# Altium schematic sheet Sheet1.SchDoc
size A; SheetNumber: 1; SheetTotal: 1
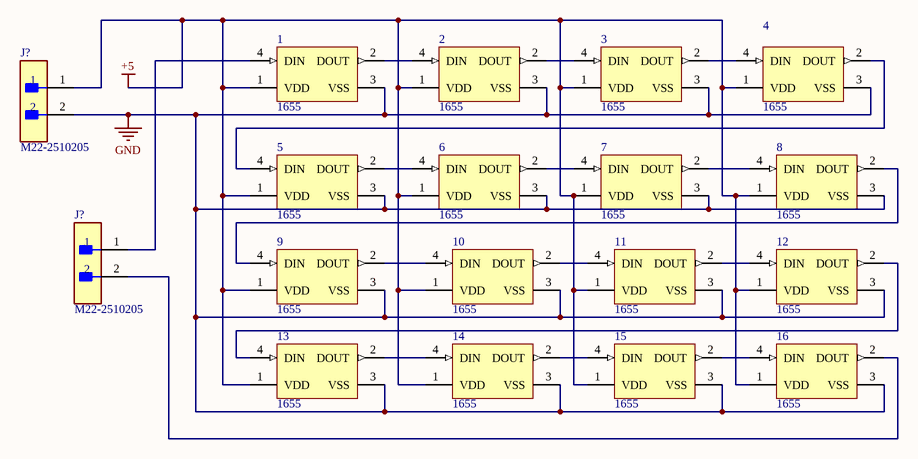
[diagram p0: Sheet1.SchDoc]

## Parts
(Parts that share a designator on the sheet are numbered #1, #2 ... from top to bottom, then left to right.)
1  1655  [ADA-RGB-1655_V]
2  1655  [ADA-RGB-1655_V]
3  1655  [ADA-RGB-1655_V]
4  1655  [ADA-RGB-1655_V]
5  1655  [ADA-RGB-1655_V]
6  1655  [ADA-RGB-1655_V]
7  1655  [ADA-RGB-1655_V]
8  1655  [ADA-RGB-1655_V]
9  1655  [ADA-RGB-1655_V]
10  1655  [ADA-RGB-1655_V]
11  1655  [ADA-RGB-1655_V]
12  1655  [ADA-RGB-1655_V]
13  1655  [ADA-RGB-1655_V]
14  1655  [ADA-RGB-1655_V]
15  1655  [ADA-RGB-1655_V]
16  1655  [ADA-RGB-1655_V]
J?#1  M22-2510205  [FP-M22-2510205-MFG]
J?#2  M22-2510205  [FP-M22-2510205-MFG]

## Nets
+5: 1.1(VDD) 2.1(VDD) 3.1(VDD) 4.1(VDD) 5.1(VDD) 6.1(VDD) 7.1(VDD) 8.1(VDD) 9.1(VDD) 10.1(VDD) 11.1(VDD) 12.1(VDD) 13.1(VDD) 14.1(VDD) 15.1(VDD) 16.1(VDD) J?#1.1
GND: 1.3(VSS) 2.3(VSS) 3.3(VSS) 4.3(VSS) 5.3(VSS) 6.3(VSS) 7.3(VSS) 8.3(VSS) 9.3(VSS) 10.3(VSS) 11.3(VSS) 12.3(VSS) 13.3(VSS) 14.3(VSS) 15.3(VSS) 16.3(VSS) J?#1.2
Net1_2: 1.2(DOUT) 2.4(DIN)
Net1_4: 1.4(DIN) J?#2.1
Net2_2: 2.2(DOUT) 3.4(DIN)
Net3_2: 3.2(DOUT) 4.4(DIN)
Net4_2: 4.2(DOUT) 5.4(DIN)
Net5_2: 5.2(DOUT) 6.4(DIN)
Net6_2: 6.2(DOUT) 7.4(DIN)
Net7_2: 7.2(DOUT) 8.4(DIN)
Net8_2: 8.2(DOUT) 9.4(DIN)
Net9_2: 9.2(DOUT) 10.4(DIN)
Net10_2: 10.2(DOUT) 11.4(DIN)
Net11_2: 11.2(DOUT) 12.4(DIN)
Net12_2: 12.2(DOUT) 13.4(DIN)
Net13_2: 13.2(DOUT) 14.4(DIN)
Net14_2: 14.2(DOUT) 15.4(DIN)
Net15_2: 15.2(DOUT) 16.4(DIN)
Net16_2: 16.2(DOUT) J?#2.2

## Library data of the parts
1-16 = CMP-2000-05026-1: Intelligent Control LED Integrated Light Source, 3.5 to 5.3 V, -25 to 80 degC, 4-Pin SMD, RoHS, Tape and Reel; Manufacturer: Adafruit-Industries-LLC; Number of LEDs: 10; Configuration: Discrete; Utilized LED: WS2812(5050); Datasheet URL: http://datasheet.octopart.com/ADA1655-Adafruit-Industries-datasheet-32028139.pdf; Series: Neopixel; Interface: -; Package Description: 4-Pin Surface Mount Device, Body 5 x 5 mm; Color: Red,Green,Blue(RGB); Category: Optoelectronics; Controller Type: -; Package Reference: 1655; Manufacturer URL: https://www.adafruit.com/; Mounting Type: SurfaceMount; Datasheet Version: May-13; Size / Dimension: 5.00mmLx5.00mmW; Family: Addressable,Specialty
J?#1 J?#2 = CMP-15831-000005-1: CONN HEADER VERT 2POS 2MM; Manufacturer: Harwin; Conn Gender: Male; Current Rating: 2A; Number Of Contacts: 2; Conn Orientation: Vertical; Temperature Range Low: -40°C; Device Class L1: Connectors; ComponentLink2URL: https://cdn.harwin.com/pdfs/C018XX_M22_Series_Connectors.pdf; Temperature Range High: +105°C; Pitch: 2mm; Number Of Rows: 1; Temperature: -40°C to +105°C; Automotive: No; Device Class L3: unset; Octopart: https://octopart.com/m22-2510205-harwin-2538221; Mouser Description: Headers & Wire Housings 2 PIN SIL VERTICAL GOLD PIN HEADER; Height: 5.45mm; Category: Conn; Digikey Description: CONN HEADER VERT 2POS 2MM; Contact Material: Gold,Nickel; Lead Free: Yes; ComponentLink2Description: Datasheet; Manufacturer Part Number: M22-2510205; Device Class L2: Headers and Wire Housings; Package: 0; Footprint Url: https://cdn.harwin.com/pdfs/M22-251.pdf; RoHS: TRUE